# Altium schematic sheet PCM2706.SchDoc
size A4; SheetNumber: 1; SheetTotal: 1
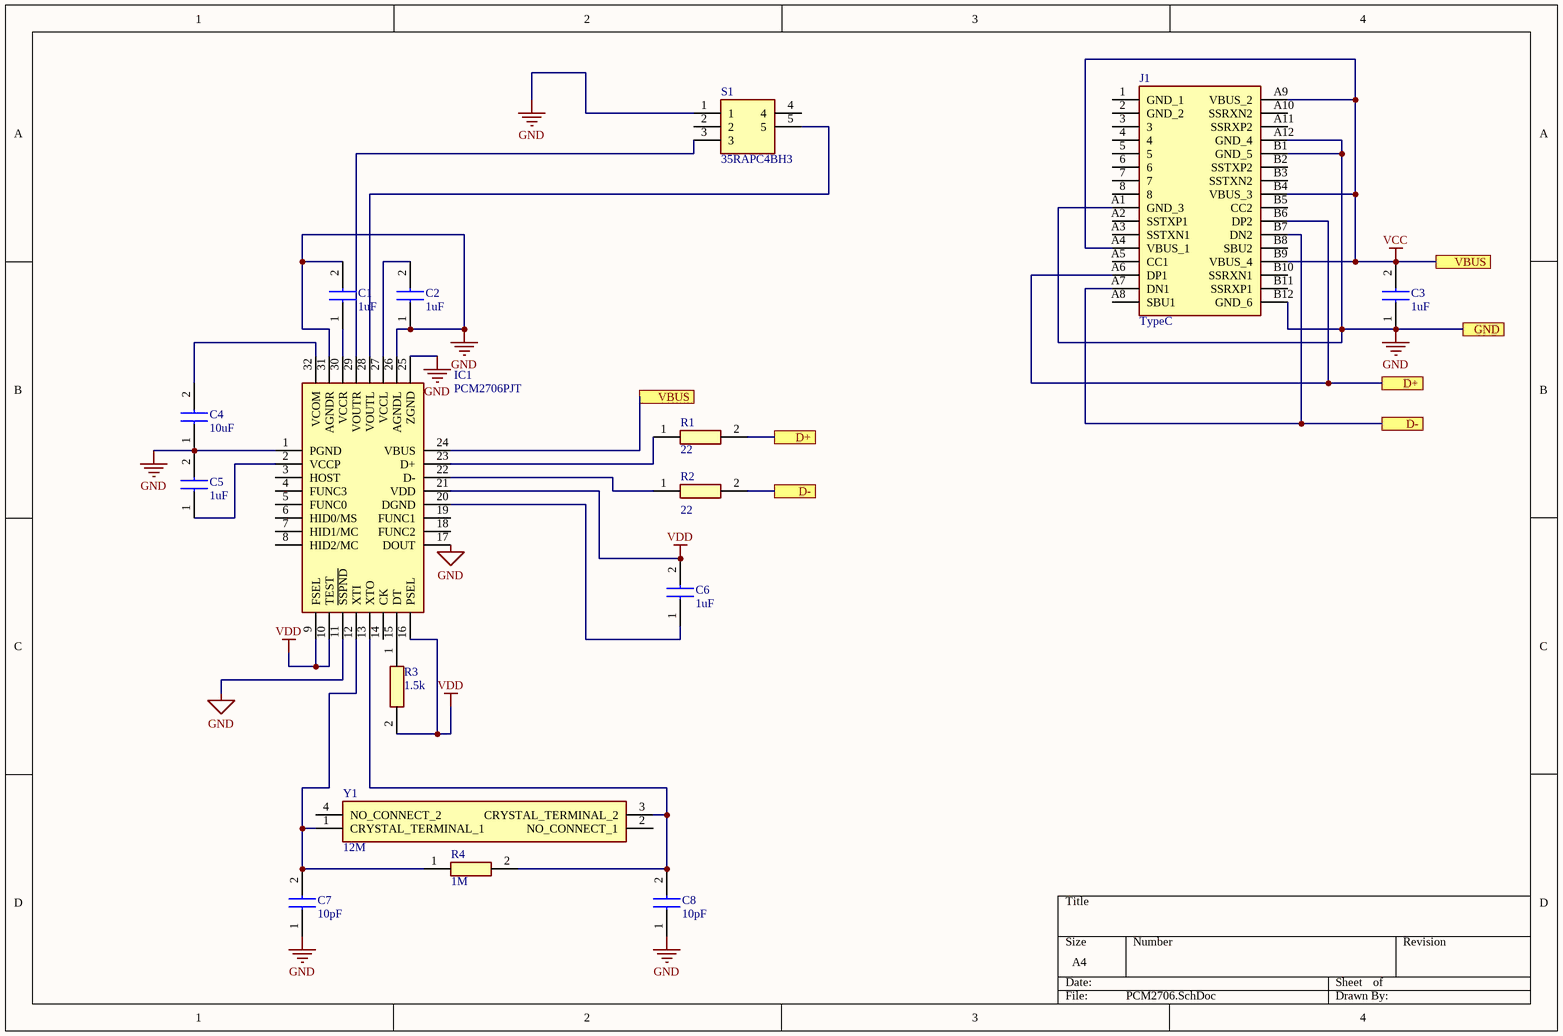
[diagram p0: PCM2706.SchDoc]

## Parts
C1  1uF  [CAPC3216X229N]
C2  1uF  [CAPC3216X229N]
C3  1uF  [CAPC3216X229N]
C4  10uF  [CAPC3216X229N]
C5  1uF  [CAPC3216X229N]
C6  1uF  [CAPC3216X229N]
C7  10pF  [CAPC3216X229N]
C8  10pF  [CAPC3216X229N]
IC1  PCM2706PJT  [QFP80P900X900X120-32N]
J1  TypeC  [632723300011]
R1  22  [RESC3116X65N]
R2  22  [RESC3116X65N]
R3  1.5k  [RESC3116X65N]
R4  1M  [RESC3116X65N]
S1  35RAPC4BH3  [35RAPC4BH3]
Y1  12M  [XRCGB24M000F2P00R0]

## Ports
D+, D-, GND, VBUS

## Nets
GND: C1.2 C2.1 C3.1 C4.1 C5.2 C7.1 C8.1 IC1.1(PGND) IC1.11(~{SSPND}) IC1.17(DOUT) IC1.25(ZGND) IC1.26(AGNDL) IC1.31(AGNDR) J1.A1(GND_3) J1.A12(GND_4) J1.B1(GND_5) J1.B12(GND_6) S1.1 ; port GND
VCC: C3.2 IC1.24(VBUS) J1.A4(VBUS_1) J1.A9(VBUS_2) J1.B4(VBUS_3) J1.B9(VBUS_4) ; port VBUS
VDD: C6.2 IC1.9(FSEL) IC1.10(TEST) IC1.16(PSEL) IC1.21(VDD) R3.2
D+: J1.A6(DP1) J1.B6(DP2) R1.2 ; port D+
D-: J1.A7(DN1) J1.B7(DN2) R2.2 ; port D-
NetC1_1: C1.1 IC1.30(VCCR)
NetC2_2: C2.2 IC1.27(VCCL)
NetC4_2: C4.2 IC1.32(VCOM)
NetC5_1: C5.1 IC1.2(VCCP)
NetC6_1: C6.1 IC1.20(DGND)
NetC7_2: C7.2 IC1.12(XTI) R4.1 Y1.1(CRYSTAL_TERMINAL_1)
NetC8_2: C8.2 IC1.13(XTO) R4.2 Y1.3(CRYSTAL_TERMINAL_2)
NetIC1_15: IC1.15(DT) R3.1
NetIC1_22: IC1.22(D-) R2.1
NetIC1_23: IC1.23(D+) R1.1
NetIC1_28: IC1.28(VOUTL) S1.5
NetIC1_29: IC1.29(VOUTR) S1.3

Not connected (* = marked no-connect by the designer): IC1 3(HOST) 4(FUNC3) 5(FUNC0) 6(HID0/MS) 7(HID1/MC) 8(HID2/MC) 14(CK) 18(FUNC2) 19(FUNC1); J1 1(GND_1) 2(GND_2) 3 4 5 6 7 8 A2(SSTXP1) A3(SSTXN1) A5(CC1) A8(SBU1) A10(SSRXN2) A11(SSRXP2) B2(SSTXP2) B3(SSTXN2) B5(CC2) B8(SBU2) B10(SSRXN1) B11(SSRXP1); S1 2 4; Y1 2(NO_CONNECT_1) 4(NO_CONNECT_2)

## Library data of the parts
C1-C8 = 1206DD106KAT2A: Capacitor; Manufacturer_Name: AVX; Datasheet Link: http://datasheets.avx.com/cx5r.pdf; Height: 2.29mm; Manufacturer_Part_Number: 1206DD106KAT2A; Mouser Part Number: 581-1206DD106KAT2A; Mouser Price/Stock: https://www.mouser.co.uk/ProductDetail/AVX/1206DD106KAT2A?qs=lhAPX%252BE7qEb%2Fwkl82gv0Wg%3D%3D; Arrow Part Number: 1206DD106KAT2A; Arrow Price/Stock: https://www.arrow.com/en/products/1206dd106kat2a/avx
IC1 = PCM2706PJT: Integrated Circuit; Manufacturer_Name: Texas Instruments; Datasheet Link: http://www.ti.com/lit/gpn/pcm2706; Height: 1.2mm; Manufacturer_Part_Number: PCM2706PJT; Mouser Part Number: 595-PCM2706PJT; Mouser Price/Stock: https://www.mouser.co.uk/ProductDetail/Texas-Instruments/PCM2706PJT?qs=wgAEGBTxy7mjI4tusM1abw%3D%3D; Arrow Part Number: PCM2706PJT; Arrow Price/Stock: https://www.arrow.com/en/products/pcm2706pjt/texas-instruments?region=nac
J1 = 632723300011: Connector; Manufacturer_Name: Wurth Elektronik; Datasheet Link: http://katalog.we-online.de/em/datasheet/632723x00011.pdf; Height: 2mm; Manufacturer_Part_Number: 632723300011; Mouser Part Number: 710-632723300011; Mouser Price/Stock: https://www.mouser.co.uk/ProductDetail/Wurth-Elektronik/632723300011?qs=NK6InXoXhq4%252B5eM1PePLPg%3D%3D
R1-R4 = RC1206FR-072K49L: Resistor; Manufacturer_Name: YAGEO (PHYCOMP); Datasheet Link: https://www.yageo.com/upload/media/product/productsearch/datasheet/rchip/PYu-RC_Group_51_RoHS_L_10.pdf; Height: 0.65mm; Manufacturer_Part_Number: RC1206FR-072K49L; Mouser Part Number: 603-RC1206FR-072K49L; Mouser Price/Stock: https://www.mouser.co.uk/ProductDetail/YAGEO/RC1206FR-072K49L?qs=fiyQ2z0a5enkp4BEXpmN7g%3D%3D; Arrow Part Number: RC1206FR-072K49L; Arrow Price/Stock: https://www.arrow.com/en/products/rc1206fr-072k49l/yageo?region=nac
S1 = 35RAPC4BH3: Switch; Manufacturer_Name: Switchcraft; Datasheet Link: http://www.switchcraft.com/Drawings/35rapc__h3_cd.pdf; Height: 6mm; Manufacturer_Part_Number: 35RAPC4BH3; Mouser Part Number: 502-35RAPC4BH3; Mouser Price/Stock: https://www.mouser.co.uk/ProductDetail/Switchcraft/35RAPC4BH3?qs=I3kMT7EEIOWFGyk5rynRAQ%3D%3D; Arrow Part Number: 35RAPC4BH3; Arrow Price/Stock: https://www.arrow.com/en/products/35rapc4bh3/switchcraft
Y1 = XRCGB24M000F2P00R0: Crystal or Oscillator; Manufacturer_Name: Murata Electronics; Datasheet Link: https://www.murata.com/products/productdata/8801075560478/SPEC-XRCGB24M000F2P00R0.pdf?1541043009000; Height: 0.7mm; Manufacturer_Part_Number: XRCGB24M000F2P00R0; Mouser Part Number: 81-XRCGB24M000F2P0R0; Mouser Price/Stock: https://www.mouser.com/Search/Refine.aspx?Keyword=81-XRCGB24M000F2P0R0; Arrow Part Number: XRCGB24M000F2P00R0; Arrow Price/Stock: https://www.arrow.com/en/products/xrcgb24m000f2p00r0/murata-manufacturing